# EAGLE design miniDAC (EAGLE 6.6.0)
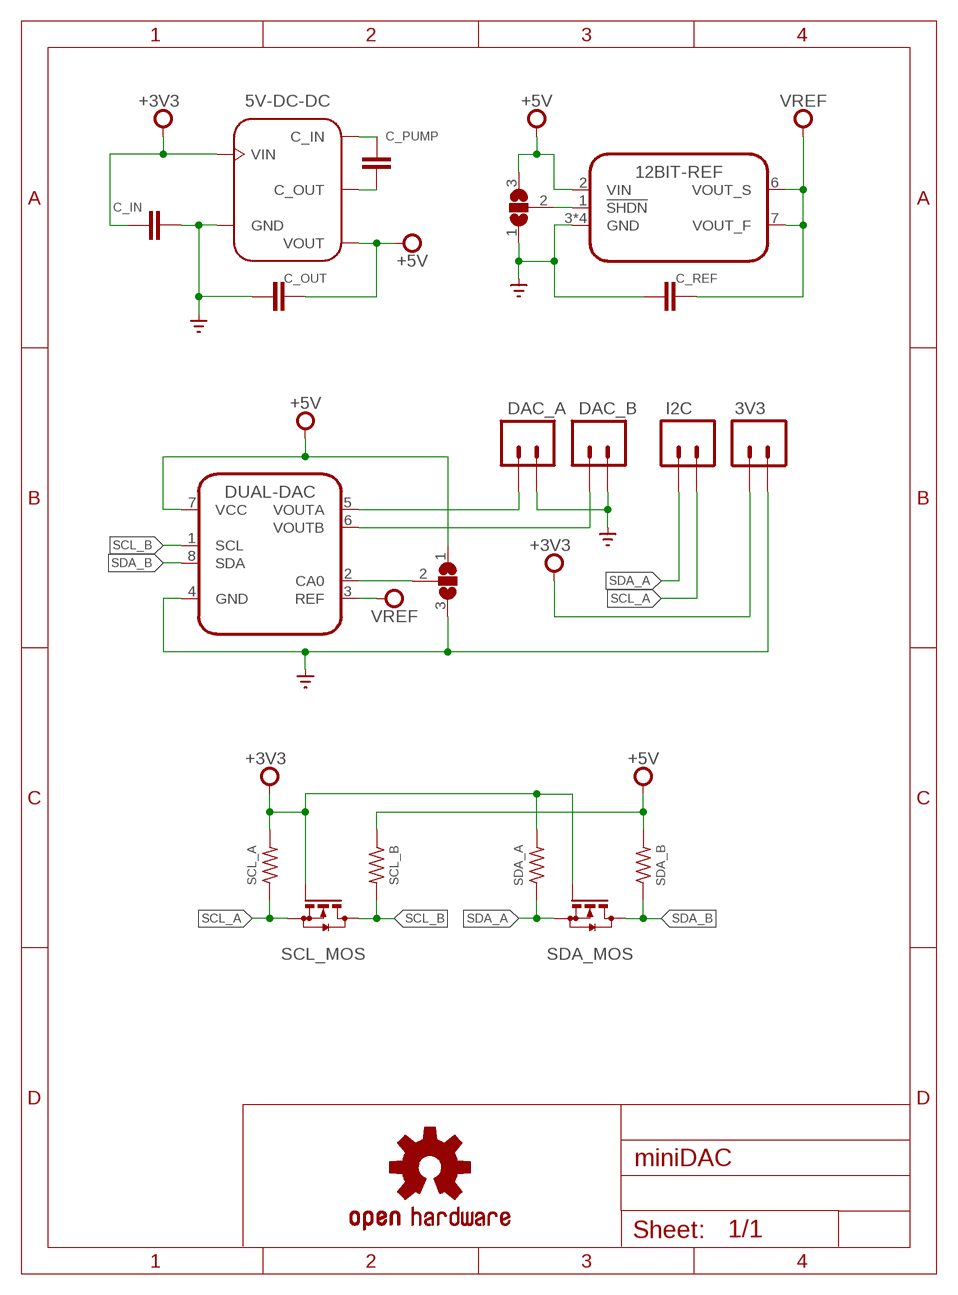
[diagram p0: schematic, sheet 1]

## Parts
3V3  M02LOCK  [1X02_LOCK]
5V-DC-DC  LTC1517CS5-5#PBF  [SOT-23_S5]
12BIT-REF  LTC6655CHMS8-5PBF  [SOP65P490X110-8N]
ADDR_SEL  SJ2WW  [SJ_2W]
C_IN  3.3uF  C-EUC1206K  [C1206K]
C_OUT  6.8uF  C-EUC1206K  [C1206K]
C_PUMP  0.1uF  C-EUC1206K  [C1206K]
C_REF  10uF  C-EUC1206K  [C1206K]
DAC_A  M025MM  [SCREWTERMINAL-5MM-2]
DAC_B  M025MM  [SCREWTERMINAL-5MM-2]
DUAL-DAC  LTC2633CTS8-HZ8PBF  [SOT65P280X100-8N]
I2C  M02LOCK  [1X02_LOCK]
OSHW  OSHW-LOGOL  [OSHW-LOGO-L]
REF_SEL  SJ2WW  [SJ_2W]
SCL_A  2.7K  R-US_M1206  [M1206]
SCL_B  1.3K  R-US_M1206  [M1206]
SCL_MOS  BSS123  [SOT23]
SDA_A  2.7K  R-US_M1206  [M1206]
SDA_B  1.3K  R-US_M1206  [M1206]
SDA_MOS  BSS123  [SOT23]

## Nets
!SHDN: 12BIT-REF.1(!SHDN) REF_SEL.2
+3V3: 3V3.1 5V-DC-DC.VIN C_IN.1 SCL_A.2 SCL_MOS.1(G) SDA_A.2 SDA_MOS.1(G)
+5V: 5V-DC-DC.VOUT 12BIT-REF.2(VIN) ADDR_SEL.1 C_OUT.2 DUAL-DAC.7(VCC) REF_SEL.3 SCL_B.1 SDA_B.2
C_IN: 5V-DC-DC.C_OUT(C_IN) C_PUMP.1
C_OUT: 5V-DC-DC.C_IN(C_OUT) C_PUMP.2
CA0: ADDR_SEL.2 DUAL-DAC.2(CA0)
DAC_A: DAC_A.2 DUAL-DAC.5(VOUTA)
DAC_B: DAC_B.2 DUAL-DAC.6(VOUTB)
GND: 3V3.2 5V-DC-DC.GND 12BIT-REF.3(GND) 12BIT-REF.4(GND) 12BIT-REF.5(GND) 12BIT-REF.8(GND) ADDR_SEL.3 C_IN.2 C_OUT.1 C_REF.2 DAC_A.1 DAC_B.1 DUAL-DAC.4(GND) REF_SEL.1
SCL_A: I2C.2 SCL_A.1 SCL_MOS.2(S)
SCL_B: DUAL-DAC.1(SCL) SCL_B.2 SCL_MOS.3(D)
SDA_A: I2C.1 SDA_A.1 SDA_MOS.2(S)
SDA_B: DUAL-DAC.8(SDA) SDA_B.1 SDA_MOS.3(D)
VREF: 12BIT-REF.6(VOUT_S) 12BIT-REF.7(VOUT_F) C_REF.1 DUAL-DAC.3(REF)

## Library data of the parts
3V3 DAC_A DAC_B I2C = SparkFun:M02: Header 2 Standard 2-pin 0.1" header. Use with straight break away headers (SKU : PRT-00116), right angle break away headers (PRT-00553), swiss pins (PRT-00743), machine pins (PRT-00117), and female headers (PRT-00115). Molex polarized connector foot print use with SKU : PRT-08233 with associated crimp pins and housings.
5V-DC-DC = LTC1517:LTC1517CS5-5#PBF
12BIT-REF = LTC6655CHMS8-5PBF:LTC6655CHMS8-5PBF: 0.25ppm Noise, Low Drift Precision Buffered Reference; AVAILABILITY: Warning; DESCRIPTION: Voltage reference [Linear Technology] LTC6655CHMS8-5#PBF Voltage reference; MF: Linear Technology; MP: LTC6655CHMS8-5#PBF; PACKAGE: MSOP-8 Linear Technology; PRICE: 5.84 USD
ADDR_SEL REF_SEL = jumper:SJ2W: SMD solder JUMPER
C_IN C_OUT C_PUMP C_REF = rcl:C-EU: CAPACITOR, European symbol
DUAL-DAC = LTC2633CTS8-HZ8PBF:LTC2633CTS8-HZ8PBF: DAC; AVAILABILITY: Warning; DESCRIPTION: IC, DAC, 8 bit, 200 kSPS, TSOT-23-8; MF: Linear Technology; MP: LTC2633CTS8-HZ8#PBF; PACKAGE: TSOT-23 Linear Technology; PRICE: 2.17 USD
OSHW = SparkFun-Aesthetics:OSHW-LOGO: Open Source Hardware Logo This logo indicates the piece of hardware it is found on incorporates a OSHW license and/or adheres to the definition of open source hardware found here: http://freedomdefined.org/OSHW
SCL_A SCL_B SDA_A SDA_B = rcl:R-US_: RESISTOR, American symbol
SCL_MOS SDA_MOS = transistor-small-signal:BSS123: N-CHANNEL MOS FET

## Board
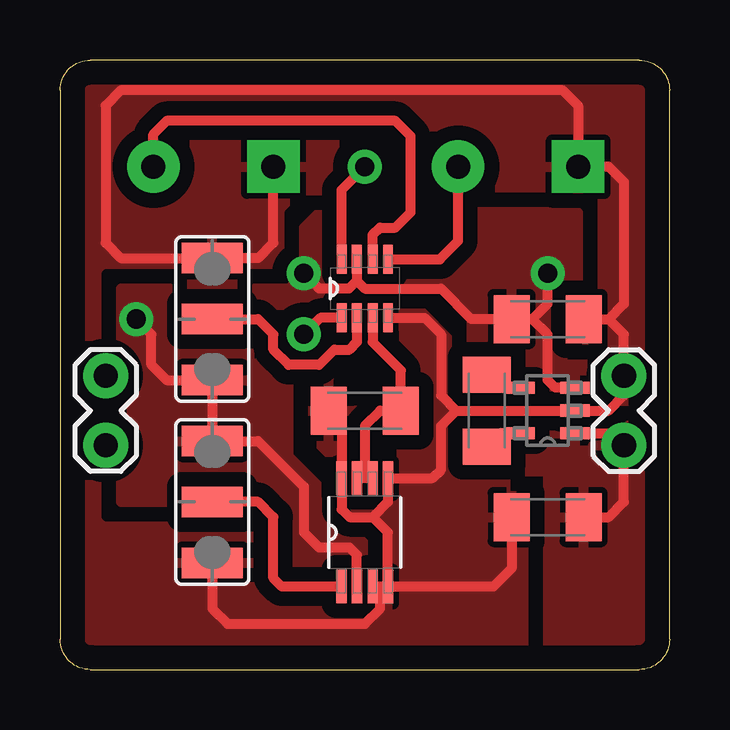
[diagram p1: board, top side]
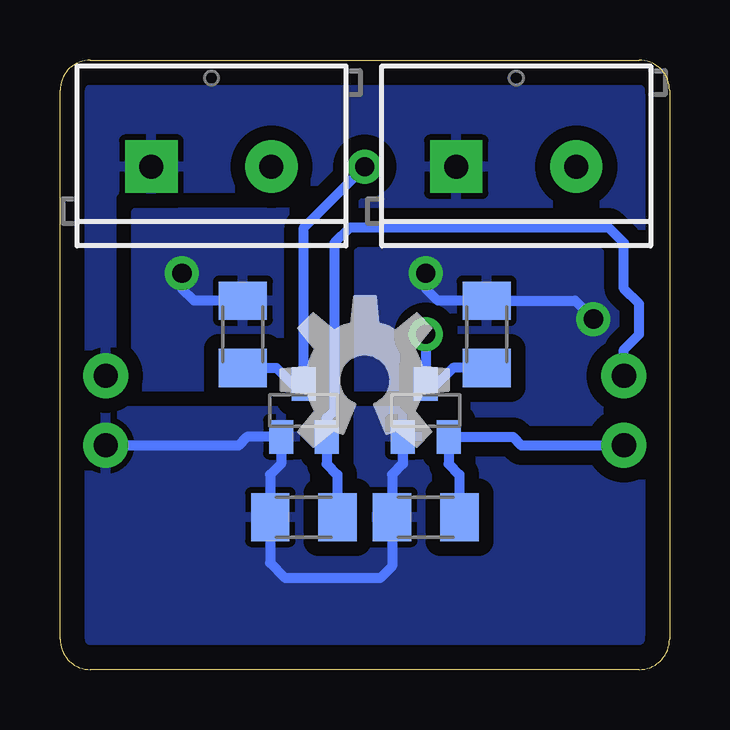
[diagram p2: board, bottom side, seen from below]

Size 25.4 x 25.4 mm. Coordinates in mm from the lower left corner, seen from the top.
Outline: 0,24.13 0,1.27 arc90 1.27,0 24.13,0 arc90 25.4,1.27 25.4,24.13 arc90 24.13,25.4 1.27,25.4 arc90 0,24.13
Copper layers (1*16): Top 0.035mm / dielectric 1.5mm / Bottom 0.035mm
Design rules "default": minimum track width 10mil, minimum drill 24mil, track to track 8mil, track to pad 8mil, pad to pad 8mil, via to via 8mil, smd to smd 8mil, copper to edge 40mil, drill to drill 8mil, minimum pad ring 10mil, minimum via ring 8mil, stop-mask expansion 4mil, vias tented up to drill 0mil, thermal gap 10mil

### Footprints (pad centres in the part's own frame; a part is rotated, then mirrored left to right if it is on the bottom)
1X02_LOCK = drill 1.016 pad 1.88: 1 -0.178,0; 2 2.718,0
SOT-23_S5 = smd 0.508 x 1.219: C_IN -0.95,1.143; C_OUT 0.95,1.143; GND 0,-1.143; VIN -0.95,-1.143; VOUT 0.95,-1.143
SOP65P490X110-8N = smd 1.397 x 0.432: 1 -2.261,0.965; 2 -2.261,0.33; 3 -2.261,-0.33; 4 -2.261,-0.965; 5 2.261,-0.965; 6 2.261,-0.33; 7 2.261,0.33; 8 2.261,0.965
SJ_2W = smd 1.27 x 2.54: 1 -2.54,0; 2 0,0; 3 2.54,0
C1206K = smd 1.5 x 2: 1 -1.5,0; 2 1.5,0
SCREWTERMINAL-5MM-2 = drill 1 pad 2.184 square: 1 -2.54,0 | drill 1 pad 2.184: 2 2.46,0
SOT65P280X100-8N = smd 1.219 x 0.406: 1 -1.219,0.965; 2 -1.219,0.33; 3 -1.219,-0.33; 4 -1.219,-0.965; 5 1.219,-0.965; 6 1.219,-0.33; 7 1.219,0.33; 8 1.219,0.965
M1206 = smd 1.6 x 2: 1 -1.4,0; 2 1.4,0
SOT23 = smd 1 x 1.4: 1 -0.95,-1.1; 2 0.95,-1.1; 3 0,1.1

### Placement (x,y rotation side)
3V3  23.5,9.53 90 top
5V-DC-DC  20.32,10.79 90 top
12BIT-REF  12.7,5.71 90 top
ADDR_SEL  6.35,14.61 90 top
C_IN  20.32,6.35 180 top
C_OUT  20.32,14.61 180 top
C_PUMP  17.78,10.79 270 top
C_REF  12.7,10.79 180 top
DAC_A  19.05,20.95 0 bottom
DAC_B  6.35,20.95 0 bottom
DUAL-DAC  12.7,15.88 90 top
I2C  1.91,12.06 270 top
OSHW  12.7,12.06 0 bottom
REF_SEL  6.35,6.99 90 top
SCL_A  10.16,6.35 180 bottom
SCL_B  7.62,13.97 270 bottom
SCL_MOS  10.16,10.79 0 bottom
SDA_A  15.24,6.35 180 bottom
SDA_B  17.78,13.97 90 bottom
SDA_MOS  15.24,10.79 0 bottom

### Tracks (layer width: path | path; a pad name or v marks a point on that pad's centre or on a via)
!SHDN
  Top 0.406: 12BIT-REF.1 9.25,3.45 8.89,3.81 8.89,6.35 8.26,6.99 REF_SEL.2
+3V3
  Top 0.406: C_IN.1 22.86,6.35 23.5,6.99 3V3.1 23,9.85 5V-DC-DC.VIN
  Bottom 0.406: SCL_MOS.1 11.11,8.57 11.56,8.12 SCL_A.2 11.56,4.32 12.06,3.81 16,3.81 16.64,4.45 SDA_A.2 16.64,8.12 16.19,8.57 SDA_MOS.1 17.61,9.7 17.96,9.35 3V3.1
  pour Bottom (isolate 0.61): 25.4,0 25.4,10.79 10.16,10.79 8.89,9.53 0,9.53 0,0
  pour Top (isolate 0.61): 25.4,0 25.4,10.16 17.78,10.16 17.78,8.26 20.32,8.26 20.32,0
+5V  (via drill 0.8 pad 1.42)
  Top 0.406: 5V-DC-DC.VOUT 20.64,11.74 20.32,12.06 20.32,13.97 19.68,14.61 | 19.68,14.61 C_OUT.2 17.14,14.61 15.88,15.88 12.7,15.88 12.37,16.2 | 12BIT-REF.2 12.37,4.78 12.06,5.08 10.79,5.08 10.16,5.71 10.16,7.62 8.26,9.53 REF_SEL.3 ADDR_SEL.1 4.45,12.06 3.81,12.7 3.81,13.97 v3.17,14.61 | 12.37,16.2 12.04,15.88 10.79,15.88 v10.16,16.51 | DUAL-DAC.7 12.37,16.2 | 19.68,14.61 20.32,15.24 v20.32,16.51
  Bottom 0.406: SDA_B.2 19.82,15.37 20.32,15.88 v20.32,16.51 | v10.16,16.51 10.16,15.88 9.65,15.37 SCL_B.1 3.94,15.37 v3.17,14.61
  pour Top (isolate 0.61, rank 2): 10.79,19.05 10.16,18.41 10.16,16.51 9.53,15.88 2.54,15.88 2.54,6.99 8.26,6.99 8.89,6.35 8.89,3.17 13.34,3.17 13.34,5.08 12.7,5.71 11.43,5.71 10.79,6.35 10.79,7.62 9.53,8.89 9.53,12.06 10.16,12.7 12.06,12.7 12.06,15.24 12.7,15.88 15.88,15.88 17.14,14.61 17.14,12.06 17.78,11.43 22.23,11.43 22.23,12.7 20.95,12.7 20.95,15.24 21.59,15.88 21.59,19.05
  pour Bottom (isolate 0.61, rank 2): 1.91,17.78 1.91,15.88 1.27,15.24 1.27,13.97 1.91,13.34 1.91,9.53 8.89,9.53 10.16,10.79 22.23,10.79 22.23,19.05 15.24,19.05 14.61,18.41 2.54,18.41
C_IN
  Top 0.406: 5V-DC-DC.C_OUT 18.33,11.74 C_PUMP.1
C_OUT
  Top 0.406: 5V-DC-DC.C_IN 18.33,9.85 C_PUMP.2
CA0
  Top 0.406: DUAL-DAC.2 12.37,13.64 12.06,13.34 11.43,13.34 10.79,12.7 9.53,12.7 8.89,13.34 8.89,13.97 8.26,14.61 ADDR_SEL.2
DAC_A
  Top 0.406: DUAL-DAC.5 15.82,17.09 16.59,17.86 DAC_A.2
DAC_B
  Top 0.406: DUAL-DAC.6 13.03,18.11 13.34,18.41 13.97,18.41 14.61,19.05 14.61,22.23 13.97,22.86 4.45,22.86 3.89,22.3 DAC_B.2
GND
  Top 0.406: 12BIT-REF.4 12BIT-REF.3 | 13.03,6.35 12.06,6.35 11.73,6.68 12BIT-REF.8 11.73,10.26 C_REF.2 | 12BIT-REF.4 13.66,5.71 13.03,6.35 | C_OUT.1 22.86,14.61 | 22.86,14.61 23.5,15.24 23.5,20.32 22.86,20.95 DAC_A.1 21.59,23.5 20.95,24.13 2.54,24.13 1.91,23.5 1.91,17.78 2.54,17.14 ADDR_SEL.3 8.26,17.14 8.89,17.78 DAC_B.1 | 22.86,14.61 23.5,13.97 3V3.2 23.5,11.43 22.86,10.79 5V-DC-DC.GND 16.51,10.79 | 13.06,3.45 12BIT-REF.3 | 16.51,10.79 15.88,11.43 15.88,13.97 15.19,14.66 DUAL-DAC.4 | 16.51,10.79 15.88,10.16 15.88,8.33 15.52,7.98 12BIT-REF.5 13.66,6.99 13.03,6.35 | C_IN.2 18.82,4.21 18.06,3.45 12BIT-REF.4 | REF_SEL.1 6.35,2.54 6.99,1.91 12.7,1.91 13.34,2.54 13.34,3.15 12BIT-REF.3
  pour Bottom (isolate 0.61, rank 3): 0,1.27 arc90 1.27,0 24.13,0 arc90 25.4,1.27 25.4,24.13 arc90 24.13,25.4 1.27,25.4 arc90 0,24.13
  pour Top (isolate 0.61, rank 3): 0,1.27 arc90 1.27,0 24.13,0 arc90 25.4,1.27 25.4,24.13 arc90 24.13,25.4 1.27,25.4 arc90 0,24.13
SCL_A
  Bottom 0.406: I2C.2 6.17,9.35 6.52,9.7 SCL_MOS.2 9.21,8.57 8.76,8.12 SCL_A.1
SCL_B  (via drill 0.8 pad 1.42)
  Top 0.406: DUAL-DAC.1 10.85,14.66 v10.16,13.97
  Bottom 0.406: v10.16,13.97 SCL_MOS.3 9.7,11.89 9.02,12.57 SCL_B.2 7.62,12.7
SDA_A
  Bottom 0.406: SDA_A.1 13.84,8.12 14.29,8.57 SDA_MOS.2 14.29,10.47 13.97,10.79 13.97,17.78 13.34,18.41 2.54,18.41 1.91,17.78 1.91,15.88 1.27,15.24 1.27,13.97 1.91,13.34 I2C.1
SDA_B  (via drill 0.8 pad 1.42)
  Top 0.406: DUAL-DAC.8 11.73,19.99 v12.7,20.95
  Bottom 0.406: v12.7,20.95 15.24,18.41 SDA_MOS.3 15.71,11.89 16.38,12.57 SDA_B.1
VREF
  Top 0.406: 12BIT-REF.6 12BIT-REF.7 12.42,7.98 12.7,8.26 12.7,10.16 13.34,10.79 C_REF.1 14.2,12.47 13.03,13.64 DUAL-DAC.3